# EAGLE schematic Replicape_A4 (EAGLE 6.5.0)
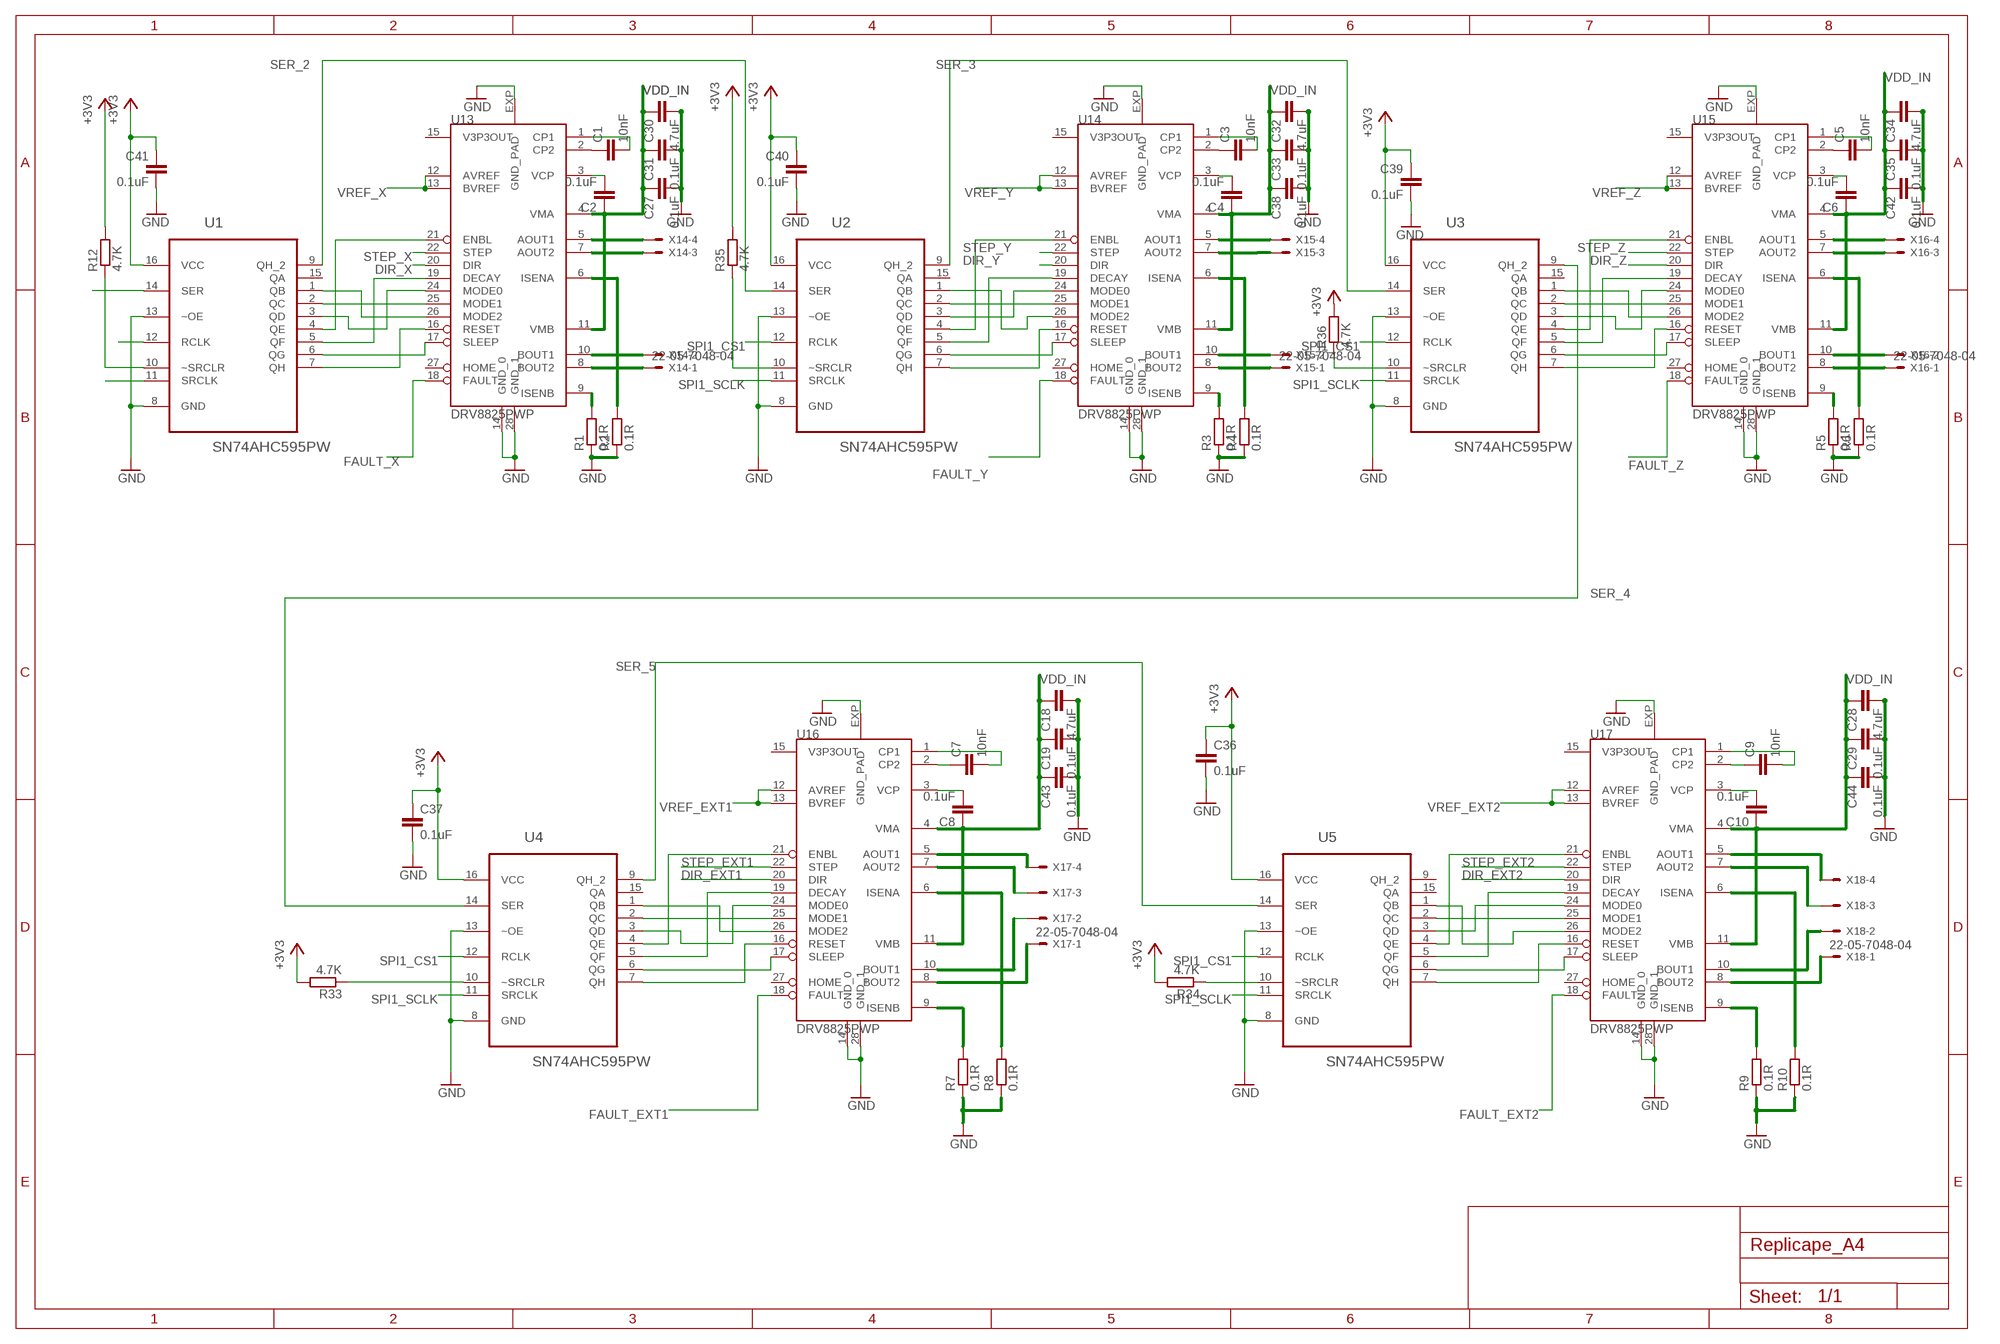
[diagram p0: schematic, sheet 1, part 1 of 3]
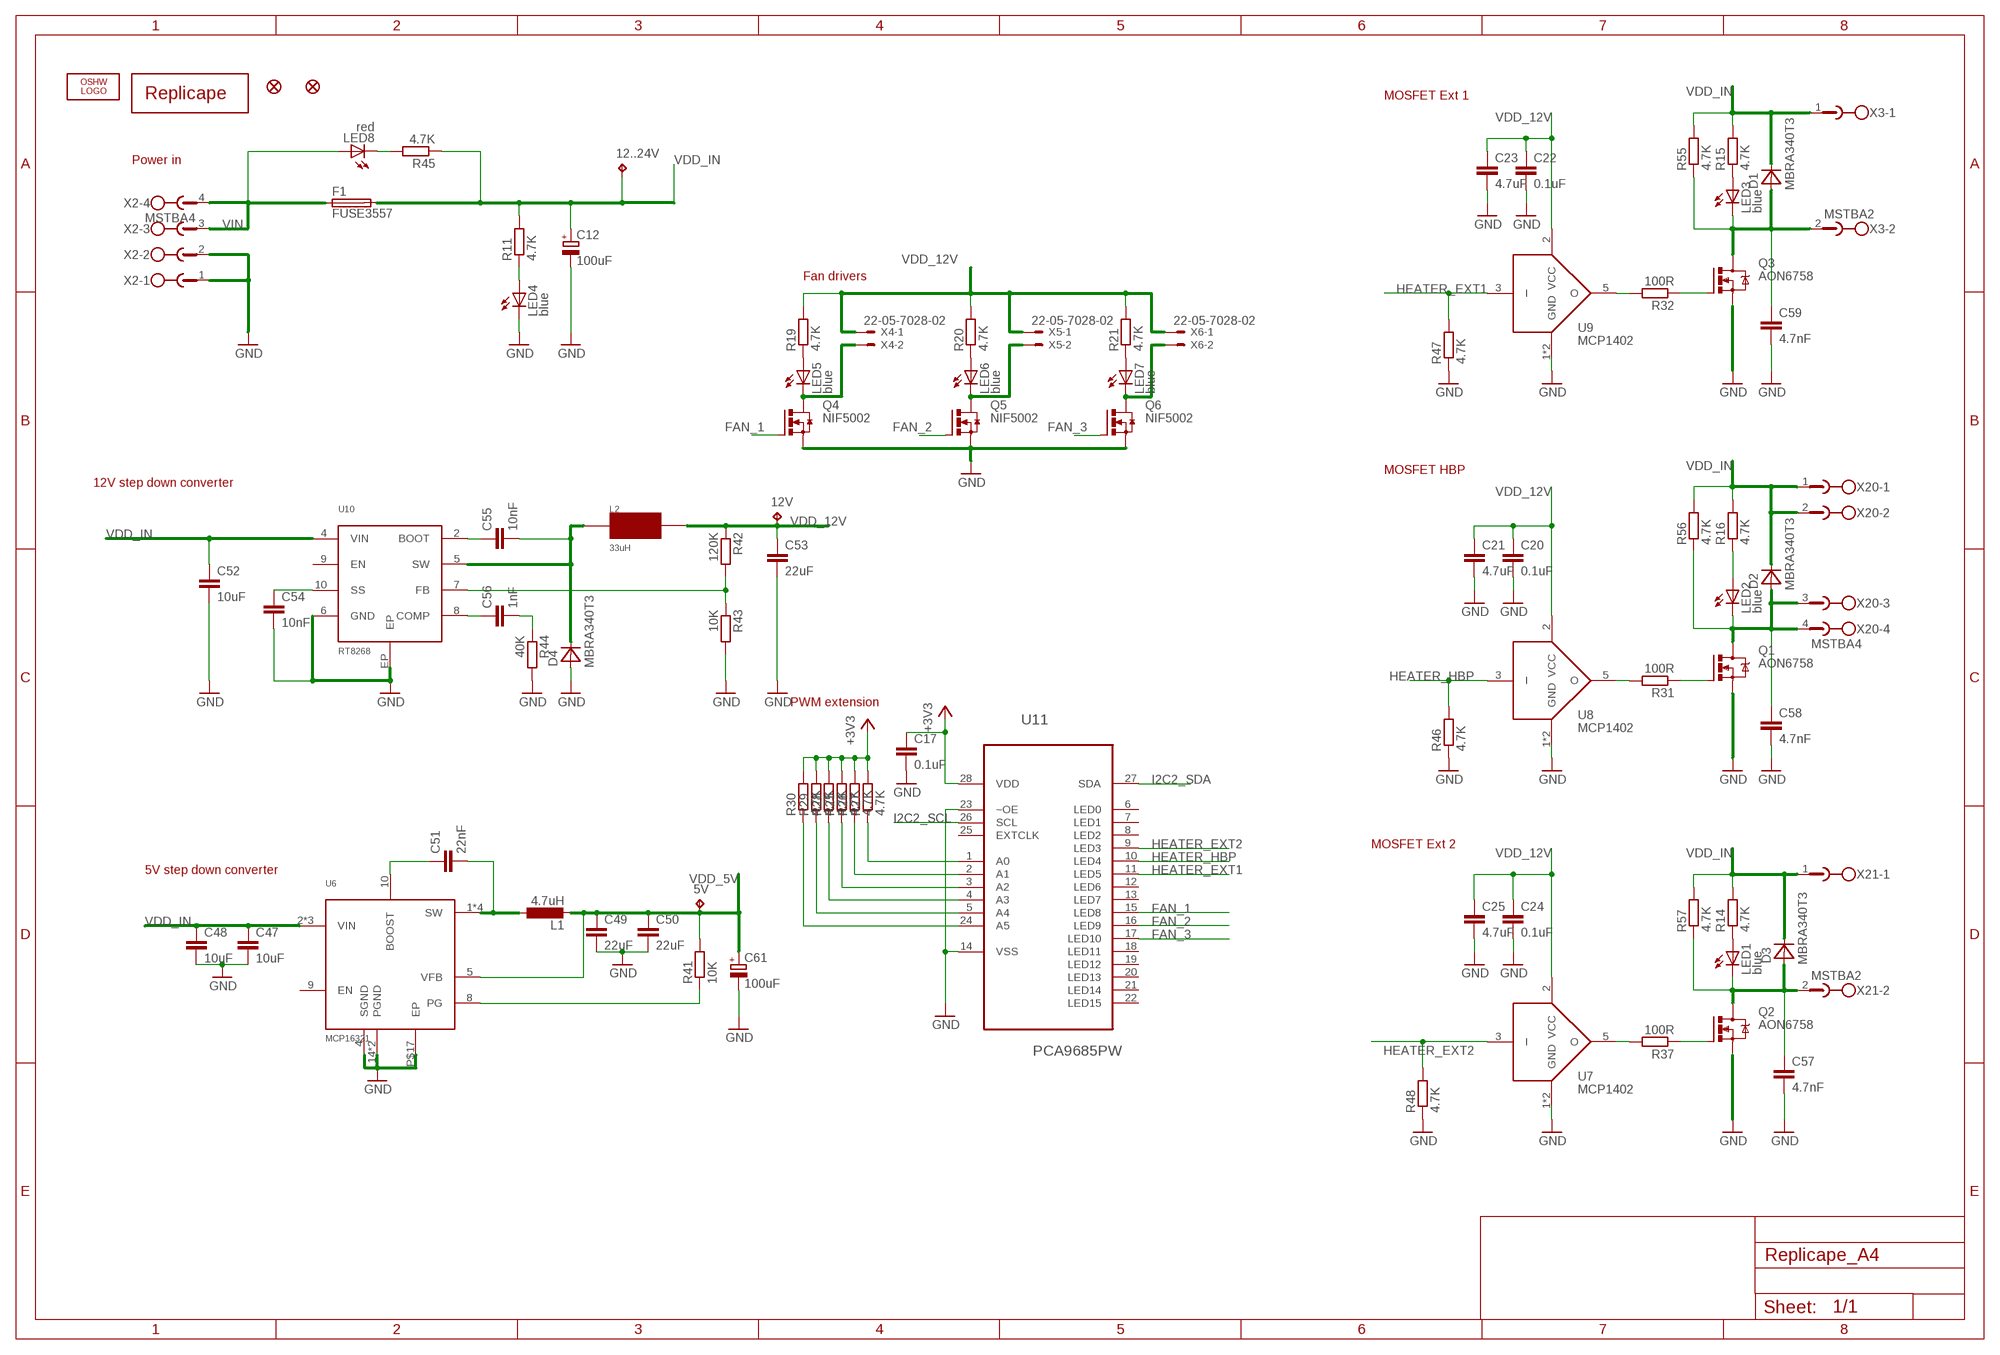
[diagram p1: schematic, sheet 1, part 2 of 3]
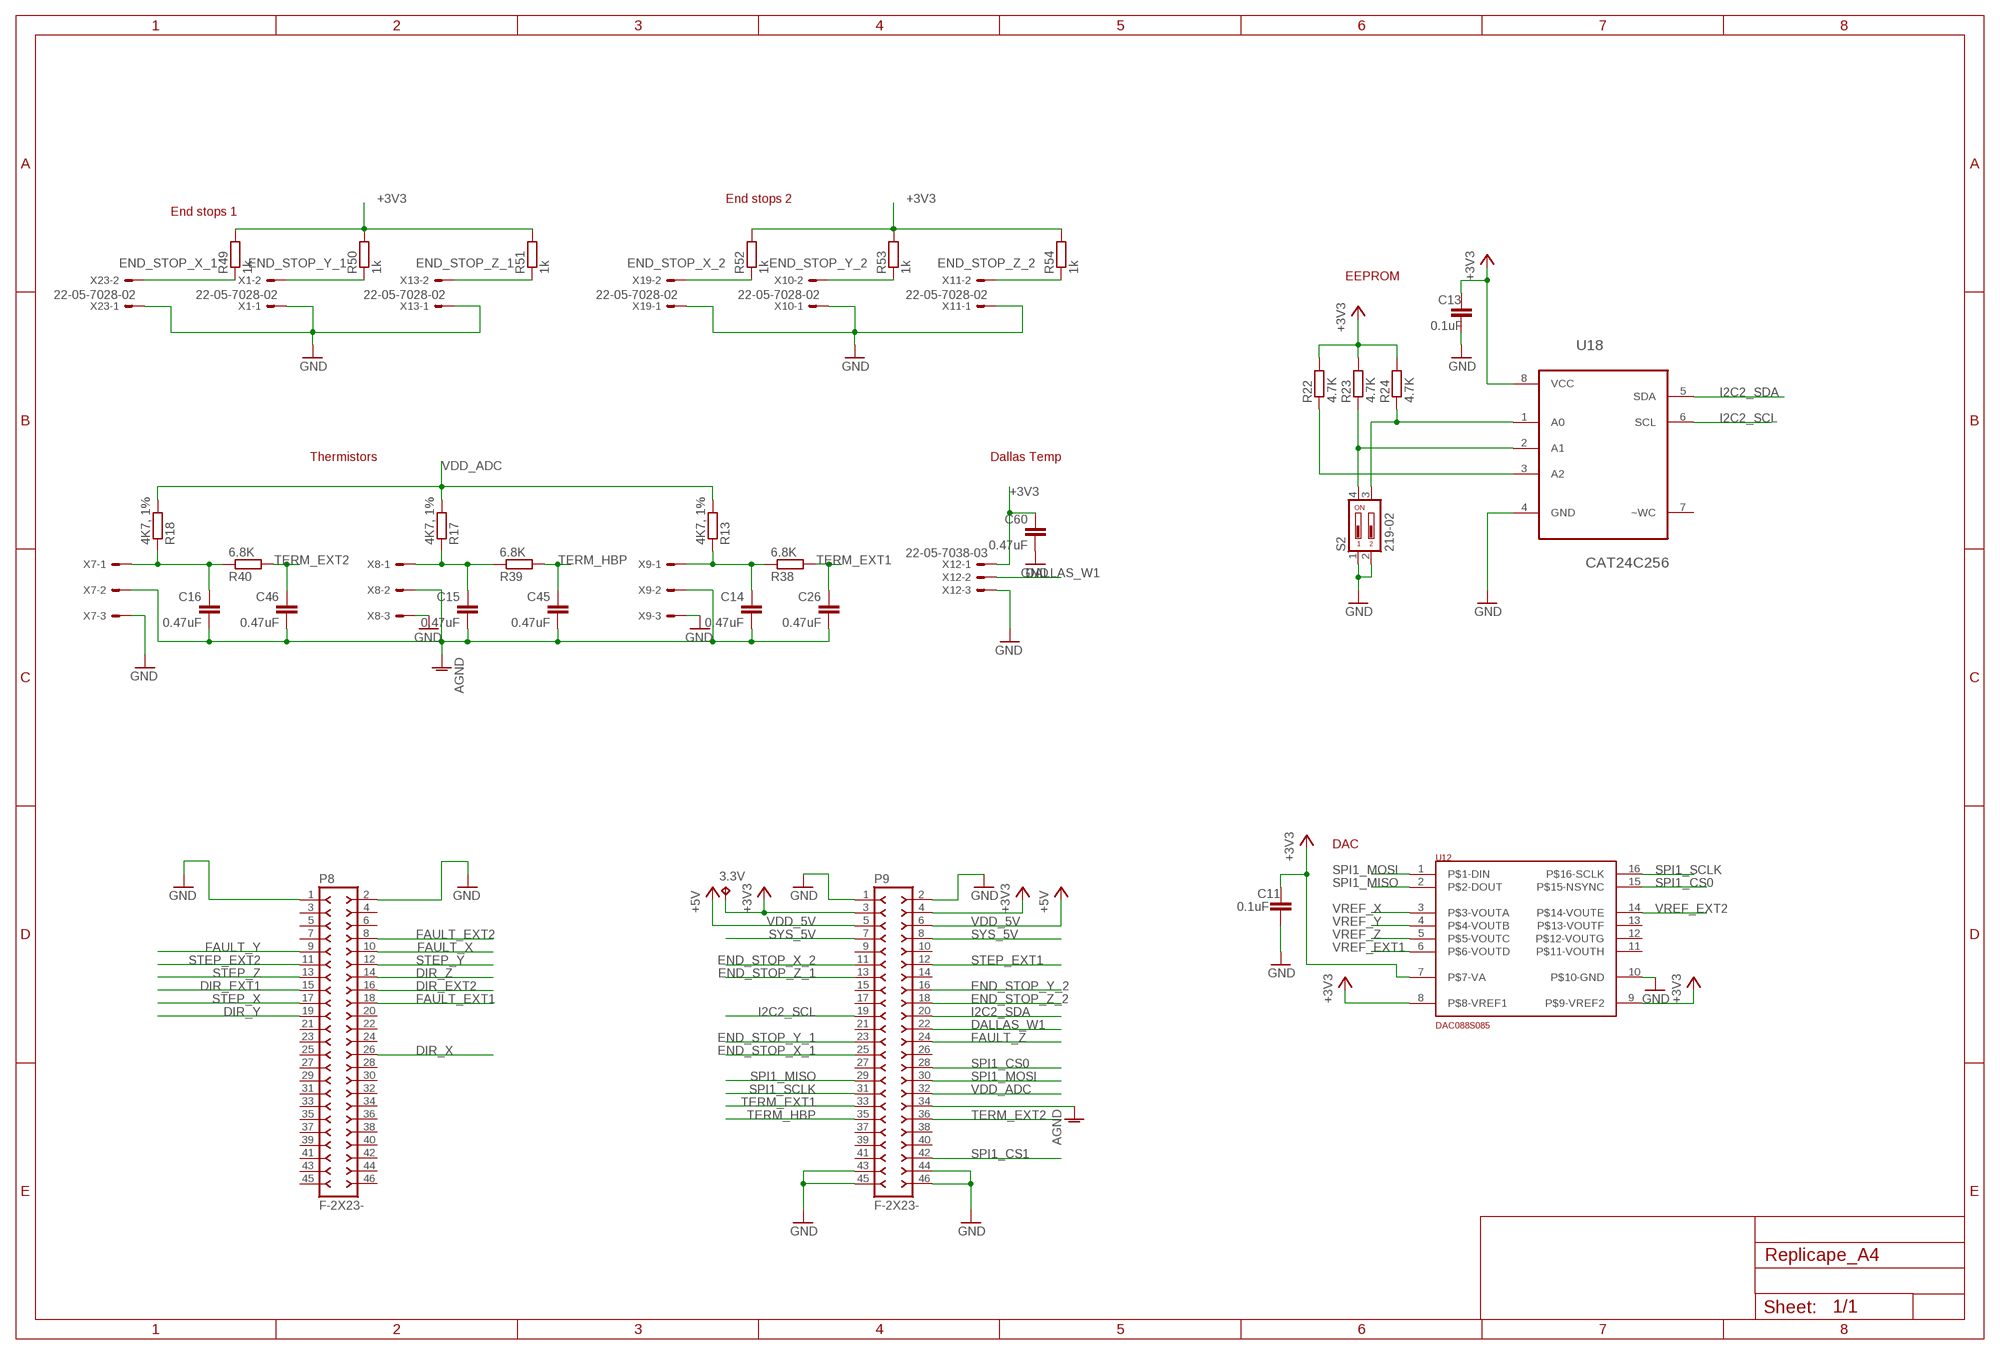
[diagram p2: schematic, sheet 1, part 3 of 3]

## Parts
3.3V  TPB1,27  [B1,27]
5V  TPB1,27  [B1,27]
12..24V  TPB1,27  [B1,27]
12V  TPB1,27  [B1,27]
C1  10nF  C-EUC0402  [C0402]
C2  0.1uF  C-EUC0402  [C0402]
C3  10nF  C-EUC0402  [C0402]
C4  0.1uF  C-EUC0402  [C0402]
C5  10nF  C-EUC0402  [C0402]
C6  0.1uF  C-EUC0402  [C0402]
C7  10nF  C-EUC0402  [C0402]
C8  0.1uF  C-EUC0402  [C0402]
C9  10nF  C-EUC0402  [C0402]
C10  0.1uF  C-EUC0402  [C0402]
C11  0.1uF  C-EUC0402  [C0402]
C12  100uF  CPOL-EU140CLH-0810  [140CLH-0810]
C13  0.1uF  C-EUC0402  [C0402]
C14  0.47uF  C-EUC0402  [C0402]
C15  0.47uF  C-EUC0402  [C0402]
C16  0.47uF  C-EUC0402  [C0402]
C17  0.1uF  C-EUC0402  [C0402]
C18  4.7uF  C-EUC0603  [C0603]
C19  0.1uF  C-EUC0402  [C0402]
C20  0.1uF  C-EUC0402  [C0402]
C21  4.7uF  C-EUC0402  [C0402]
C22  0.1uF  C-EUC0402  [C0402]
C23  4.7uF  C-EUC0402  [C0402]
C24  0.1uF  C-EUC0402  [C0402]
C25  4.7uF  C-EUC0402  [C0402]
C26  0.47uF  C-EUC0402  [C0402]
C27  0.1uF  C-EUC0402  [C0402]
C28  4.7uF  C-EUC0603  [C0603]
C29  0.1uF  C-EUC0402  [C0402]
C30  4.7uF  C-EUC0603  [C0603]
C31  0.1uF  C-EUC0402  [C0402]
C32  4.7uF  C-EUC0603  [C0603]
C33  0.1uF  C-EUC0402  [C0402]
C34  4.7uF  C-EUC0603  [C0603]
C35  0.1uF  C-EUC0402  [C0402]
C36  0.1uF  C-EUC0402  [C0402]
C37  0.1uF  C-EUC0402  [C0402]
C38  0.1uF  C-EUC0402  [C0402]
C39  0.1uF  C-EUC0402  [C0402]
C40  0.1uF  C-EUC0402  [C0402]
C41  0.1uF  C-EUC0402  [C0402]
C42  0.1uF  C-EUC0402  [C0402]
C43  0.1uF  C-EUC0402  [C0402]
C44  0.1uF  C-EUC0402  [C0402]
C45  0.47uF  C-EUC0402  [C0402]
C46  0.47uF  C-EUC0402  [C0402]
C47  10uF  C-EUC1206  [C1206]
C48  10uF  C-EUC1206  [C1206]
C49  22uF  C-EUC0805  [C0805]
C50  22uF  C-EUC0805  [C0805]
C51  22nF  C-EUC0402  [C0402]
C52  10uF  C-EUC1206  [C1206]
C53  22uF  C-EUC0805  [C0805]
C54  10nF  C-EUC0402  [C0402]
C55  10nF  C-EUC0402  [C0402]
C56  1nF  C-EUC0402  [C0402]
C57  4.7nF  C-EUC0402  [C0402]
C58  4.7nF  C-EUC0402  [C0402]
C59  4.7nF  C-EUC0402  [C0402]
C60  0.47uF  C-EUC0402  [C0402]
C61  100uF  CPOL-EU140CLH-0810  [140CLH-0810]
D1  MBRA340T3  [SMA]
D2  MBRA340T3  [SMA]
D3  MBRA340T3  [SMA]
D4  MBRA340T3  [SMA]
F1  FUSE3557  [3557]
JP1  FIDUCIAL1X2.5  [FIDUCIAL-1X2.5]
JP2  FIDUCIAL1X2.5  [FIDUCIAL-1X2.5]
L1  4.7uH  L-EUVLC  [VLC5020]
L2  33uH  RT8040T330  [NR8040T330]
LED1  blue  LEDCHIP-LED0603  [CHIP-LED0603]
LED2  blue  LEDCHIP-LED0603  [CHIP-LED0603]
LED3  blue  LEDCHIP-LED0603  [CHIP-LED0603]
LED4  blue  LEDCHIP-LED0603  [CHIP-LED0603]
LED5  blue  LEDCHIP-LED0603  [CHIP-LED0603]
LED6  blue  LEDCHIP-LED0603  [CHIP-LED0603]
LED7  blue  LEDCHIP-LED0603  [CHIP-LED0603]
LED8  red  LEDCHIP-LED0603  [CHIP-LED0603]
LOGO1  OSHW_LOGO_FILLX0200-NT  [OSHW_FILLX200_NOTEXT]
P8  F-2X23-  [DIL-100-2X23]
P9  F-2X23-  [DIL-100-2X23]
Q1  AON6758  [8-DFN-EP-(5X6)]
Q2  AON6758  [8-DFN-EP-(5X6)]
Q3  AON6758  [8-DFN-EP-(5X6)]
Q4  NIF5002  N-HEXFET-2D_SOT232-  [SOT223]
Q5  NIF5002  N-HEXFET-2D_SOT232-  [SOT223]
Q6  NIF5002  N-HEXFET-2D_SOT232-  [SOT223]
R1  0.1R  R-EU_R0805  [R0805]
R2  0.1R  R-EU_R0805  [R0805]
R3  0.1R  R-EU_R0805  [R0805]
R4  0.1R  R-EU_R0805  [R0805]
R5  0.1R  R-EU_R0805  [R0805]
R6  0.1R  R-EU_R0805  [R0805]
R7  0.1R  R-EU_R0805  [R0805]
R8  0.1R  R-EU_R0805  [R0805]
R9  0.1R  R-EU_R0805  [R0805]
R10  0.1R  R-EU_R0805  [R0805]
R11  4.7K  R-EU_R0402  [R0402]
R12  4.7K  R-EU_R0402  [R0402]
R13  4K7, 1%  R-EU_R0402  [R0402]
R14  4.7K  R-EU_R0402  [R0402]
R15  4.7K  R-EU_R0402  [R0402]
R16  4.7K  R-EU_R0402  [R0402]
R17  4K7, 1%  R-EU_R0402  [R0402]
R18  4K7, 1%  R-EU_R0402  [R0402]
R19  4.7K  R-EU_R0402  [R0402]
R20  4.7K  R-EU_R0402  [R0402]
R21  4.7K  R-EU_R0402  [R0402]
R22  4.7K  R-EU_R0402  [R0402]
R23  4.7K  R-EU_R0402  [R0402]
R24  4.7K  R-EU_R0402  [R0402]
R25  4.7K  R-EU_R0402  [R0402]
R26  4.7K  R-EU_R0402  [R0402]
R27  4.7K  R-EU_R0402  [R0402]
R28  4.7K  R-EU_R0402  [R0402]
R29  4.7K  R-EU_R0402  [R0402]
R30  4.7K  R-EU_R0402  [R0402]
R31  100R  R-EU_R0402  [R0402]
R32  100R  R-EU_R0402  [R0402]
R33  4.7K  R-EU_R0402  [R0402]
R34  4.7K  R-EU_R0402  [R0402]
R35  4.7K  R-EU_R0402  [R0402]
R36  4.7K  R-EU_R0402  [R0402]
R37  100R  R-EU_R0402  [R0402]
R38  6.8K  R-EU_R0402  [R0402]
R39  6.8K  R-EU_R0402  [R0402]
R40  6.8K  R-EU_R0402  [R0402]
R41  10K  R-EU_R0402  [R0402]
R42  120K  R-EU_R0402  [R0402]
R43  10K  R-EU_R0402  [R0402]
R44  40K  R-EU_R0402  [R0402]
R45  4.7K  R-EU_R0402  [R0402]
R46  4.7K  R-EU_R0402  [R0402]
R47  4.7K  R-EU_R0402  [R0402]
R48  4.7K  R-EU_R0402  [R0402]
R49  1k  R-EUR0402  [R0402]
R50  1k  R-EUR0402  [R0402]
R51  1k  R-EUR0402  [R0402]
R52  1k  R-EUR0402  [R0402]
R53  1k  R-EUR0402  [R0402]
R54  1k  R-EUR0402  [R0402]
R55  4.7K  R-EU_R0402  [R0402]
R56  4.7K  R-EU_R0402  [R0402]
R57  4.7K  R-EU_R0402  [R0402]
S2  219-02  [CTS-219-02]
U1  SN74AHC595PW  [SOP65P640X120-16N]
U2  SN74AHC595PW  [SOP65P640X120-16N]
U3  SN74AHC595PW  [SOP65P640X120-16N]
U4  SN74AHC595PW  [SOP65P640X120-16N]
U5  SN74AHC595PW  [SOP65P640X120-16N]
U6  MCP16321  [QFN-16]
U7  MCP1402  [SOT23-5L]
U8  MCP1402  [SOT23-5L]
U9  MCP1402  [SOT23-5L]
U10  RT8268  [MSOP10]
U11  PCA9685PW  [SOP65P640X110-28N]
U12  DAC088S085  [TSSOP-16]
U13  DRV8825PWP  [TSSOP-28]
U14  DRV8825PWP  [TSSOP-28]
U15  DRV8825PWP  [TSSOP-28]
U16  DRV8825PWP  [TSSOP-28]
U17  DRV8825PWP  [TSSOP-28]
U18  CAT24C256  [SOIC127P600X175-8N]
U$2  REPLICAPE-LOGO  [REPLICAPE-LOGO]
X1  22-05-7028-02  [7395-02]
X2  MSTBA4  [MSTBA4]
X3  MSTBA2  [MSTBA2]
X4  22-05-7028-02  [7395-02]
X5  22-05-7028-02  [7395-02]
X6  22-05-7028-02  [7395-02]
X7  22-05-7038-03  [7395-03]
X8  22-05-7038-03  [7395-03]
X9  22-05-7038-03  [7395-03]
X10  22-05-7028-02  [7395-02]
X11  22-05-7028-02  [7395-02]
X12  22-05-7038-03  [7395-03]
X13  22-05-7028-02  [7395-02]
X14  22-05-7048-04  [7395-04]
X15  22-05-7048-04  [7395-04]
X16  22-05-7048-04  [7395-04]
X17  22-05-7048-04  [7395-04]
X18  22-05-7048-04  [7395-04]
X19  22-05-7028-02  [7395-02]
X20  MSTBA4  [MSTBA4]
X21  MSTBA2  [MSTBA2]
X23  22-05-7028-02  [7395-02]

## Nets
+3V3: 3.3V.TP C11.1 C13.1 C17.1 C36.1 C37.1 C39.1 C40.1 C41.1 C60.1 P9.3 P9.4 R12.2 R22.2 R23.2 R24.2 R25.2 R26.2 R27.2 R28.2 R29.2 R30.2 R33.2 R34.2 R35.2 R36.2 R49.2 R50.2 R51.2 R52.2 R53.2 R54.2 U1.16(VCC) U2.16(VCC) U3.16(VCC) U4.16(VCC) U5.16(VCC) U11.28(VDD) U12.7(P$7-VA) U12.8(P$8-VREF1) U12.9(P$9-VREF2) U18.8(VCC) X12.1
AGND: C14.2 C15.2 C16.2 C26.2 C45.2 C46.2 P9.34 X7.2 X8.2 X9.2
DALLAS_W1: P9.22 X12.2
DIR_EXT1: P8.15 U16.20(DIR)
DIR_EXT2: P8.16 U17.20(DIR)
DIR_X: P8.26 U13.20(DIR)
DIR_Y: P8.19 U14.20(DIR)
DIR_Z: P8.14 U15.20(DIR)
END_STOP_X_1: P9.25 R49.1 X23.2
END_STOP_X_2: P9.11 R52.1 X19.2
END_STOP_Y_1: P9.23 R50.1 X1.2
END_STOP_Y_2: P9.16 R53.1 X10.2
END_STOP_Z_1: P9.13 R51.1 X13.2
END_STOP_Z_2: P9.18 R54.1 X11.2
EXT1_DECAY: U4.5(QF) U16.19(DECAY)
EXT1_MODE0: U4.3(QD) U16.24(MODE0)
EXT1_MODE1: U4.2(QC) U16.25(MODE1)
EXT1_MODE2: U4.1(QB) U16.26(MODE2)
EXT1_NENABLE: U4.4(QE) U16.21(ENBL)
EXT1_NRESET: U4.7(QH) U16.16(RESET)
EXT1_NSLEEP: U4.6(QG) U16.17(SLEEP)
EXT2_DECAY: U5.5(QF) U17.19(DECAY)
EXT2_MODE0: U5.3(QD) U17.24(MODE0)
EXT2_MODE1: U5.2(QC) U17.25(MODE1)
EXT2_MODE2: U5.1(QB) U17.26(MODE2)
EXT2_NENABLE: U5.4(QE) U17.21(ENBL)
EXT2_NRESET: U5.7(QH) U17.16(RESET)
EXT2_NSLEEP: U5.6(QG) U17.17(SLEEP)
FAN_1: Q4.1(G) U11.15(LED8)
FAN_2: Q5.1(G) U11.16(LED9)
FAN_3: Q6.1(G) U11.17(LED10)
FAULT_EXT1: P8.18 U16.18(FAULT)
FAULT_EXT2: P8.8 U17.18(FAULT)
FAULT_X: P8.10 U13.18(FAULT)
FAULT_Y: P8.9 U14.18(FAULT)
FAULT_Z: P9.24 U15.18(FAULT)
GND: C11.2 C12.- C13.2 C17.2 C18.2 C19.2 C20.2 C21.2 C22.2 C23.2 C24.2 C25.2 C27.2 C28.2 C29.2 C30.2 C31.2 C32.2 C33.2 C34.2 C35.2 C36.2 C37.2 C38.2 C39.2 C40.2 C41.2 C42.2 C43.2 C44.2 C47.2 C48.2 C49.2 C50.2 C52.2 C53.2 C54.2 C57.2 C58.2 C59.2 C60.2 C61.- D4.A LED4.C P8.1 P8.2 P9.1 P9.2 P9.43 P9.44 P9.45 P9.46 Q1.1(S) Q1.2(S) Q1.3(S) Q2.1(S) Q2.2(S) Q2.3(S) Q3.1(S) Q3.2(S) Q3.3(S) Q4.3(S) Q5.3(S) Q6.3(S) R1.1 R2.1 R3.1 R4.1 R5.1 R6.1 R7.1 R8.1 R9.1 R10.1 R43.2 R44.2 R46.1 R47.1 R48.1 S2.1 S2.2 U1.8(GND) U1.13(~OE) U2.8(GND) U2.13(~OE) U3.8(GND) U3.13(~OE) U4.8(GND) U4.13(~OE) U5.8(GND) U5.13(~OE) U6.4(SGND) U6.14(PGND) U6.15(PGND) U6.P$17(EP) U7.1(GND) U7.4(GND) U8.1(GND) U8.4(GND) U9.1(GND) U9.4(GND) U10.6(GND) U10.EP U11.14(VSS) U11.23(~OE) U12.10(P$10-GND) U13.14(GND_0) U13.28(GND_1) U13.EXP(GND_PAD) U14.14(GND_0) U14.28(GND_1) U14.EXP(GND_PAD) U15.14(GND_0) U15.28(GND_1) U15.EXP(GND_PAD) U16.14(GND_0) U16.28(GND_1) U16.EXP(GND_PAD) U17.14(GND_0) U17.28(GND_1) U17.EXP(GND_PAD) U18.4(GND) X1.1 X2.1 X2.2 X7.3 X8.3 X9.3 X10.1 X11.1 X12.3 X13.1 X19.1 X23.1
HEATER_EXT1: R47.2 U9.3(I) U11.11(LED5)
HEATER_EXT2: R48.2 U7.3(I) U11.9(LED3)
HEATER_HBP: R46.2 U8.3(I) U11.10(LED4)
I2C2_SCL: P9.19 U11.26(SCL) U18.6(SCL)
I2C2_SDA: P9.20 U11.27(SDA) U18.5(SDA)
N$8: LED8.C R45.2
N$9: LED5.A R19.1
N$16: C1.1 U13.2(CP2)
N$17: C1.2 U13.1(CP1)
N$18: R1.2 U13.9(ISENB)
N$19: R2.2 U13.6(ISENA)
N$21: R32.2 U9.5(O)
N$22: C2.2 U13.3(VCP)
N$23: Q2.4(G) R37.1
N$34: C3.1 U14.2(CP2)
N$35: C3.2 U14.1(CP1)
N$36: R3.2 U14.9(ISENB)
N$37: R4.2 U14.6(ISENA)
N$38: C4.2 U14.3(VCP)
N$41: R37.2 U7.5(O)
N$52: C5.1 U15.2(CP2)
N$53: C5.2 U15.1(CP1)
N$54: R5.2 U15.9(ISENB)
N$55: R6.2 U15.6(ISENA)
N$56: C6.2 U15.3(VCP)
N$58: R27.1 U11.1(A0)
N$59: R26.1 U11.2(A1)
N$60: Q1.4(G) R31.1
N$61: R31.2 U8.5(O)
N$64: C57.1 D3.A LED1.C Q2.5(D) Q2.6(D) Q2.7(D) Q2.8(D) Q2.TH(D) R57.1 X21.2
N$70: C7.1 U16.2(CP2)
N$71: C7.2 U16.1(CP1)
N$72: R7.2 U16.9(ISENB)
N$73: R8.2 U16.6(ISENA)
N$74: C8.2 U16.3(VCP)
N$76: R25.1 U11.3(A2)
N$88: C9.1 U17.2(CP2)
N$89: C9.2 U17.1(CP1)
N$90: R9.2 U17.9(ISENB)
N$91: R10.2 U17.6(ISENA)
N$92: C10.2 U17.3(VCP)
N$94: R28.1 U11.4(A3)
N$95: R29.1 U11.5(A4)
N$96: LED4.A R11.1
N$97: R12.1 U1.10(~SRCLR)
N$98: R33.1 U4.10(~SRCLR)
N$99: R34.1 U5.10(~SRCLR)
N$100: R35.1 U2.10(~SRCLR)
N$101: R36.1 U3.10(~SRCLR)
N$112: R30.1 U11.24(A5)
N$114: LED7.C Q6.2(D) Q6.4(D) X6.2
N$115: LED6.C Q5.2(D) Q5.4(D) X5.2
N$116: LED5.C Q4.2(D) Q4.4(D) X4.2
N$117: LED6.A R20.1
N$118: LED7.A R21.1
N$127: LED3.A R15.1
N$128: C51.1 U6.10(BOOST)
N$129: LED1.A R14.1
N$130: LED2.A R16.1
N$133: Q3.4(G) R32.1
N$147: R24.1 S2.3 U18.1(A0)
N$148: R23.1 S2.4 U18.2(A1)
N$149: R22.1 U18.3(A2)
N$233: R42.2 R43.1 U10.7(FB)
N$234: C59.1 D1.A LED3.C Q3.5(D) Q3.6(D) Q3.7(D) Q3.8(D) Q3.TH(D) R55.1 X3.2
N$237: C14.1 R13.1 R38.1 X9.1
N$238: C55.2 D4.C L2.P$2 U10.5(SW)
N$239: R41.1 U6.8(PG)
N$240: C16.1 R18.1 R40.1 X7.1
N$241: C15.1 R17.1 R39.1 X8.1
N$242: C58.1 D2.A LED2.C Q1.5(D) Q1.6(D) Q1.7(D) Q1.8(D) Q1.TH(D) R56.1 X20.3 X20.4
N$243: C54.1 U10.10(SS)
N$244: C56.1 U10.8(COMP)
N$245: C55.1 U10.2(BOOT)
N$246: C56.2 R44.1
SER_2: U1.9(QH_2) U2.14(SER)
SER_3: U2.9(QH_2) U3.14(SER)
SER_4: U3.9(QH_2) U4.14(SER)
SER_5: U4.9(QH_2) U5.14(SER)
SPI1_CS0: P9.28 U12.15(P$15-NSYNC)
SPI1_CS1: P9.42 U1.12(RCLK) U2.12(RCLK) U3.12(RCLK) U4.12(RCLK) U5.12(RCLK)
SPI1_MISO: P9.29 U12.2(P$2-DOUT)
SPI1_MOSI: P9.30 U1.14(SER) U12.1(P$1-DIN)
SPI1_SCLK: P9.31 U1.11(SRCLK) U2.11(SRCLK) U3.11(SRCLK) U4.11(SRCLK) U5.11(SRCLK) U12.16(P$16-SCLK)
STEP1_EXT1: U16.5(AOUT1) X17.4
STEP1_EXT2: U17.5(AOUT1) X18.4
STEP1_X: U13.5(AOUT1) X14.4
STEP1_Y: U14.5(AOUT1) X15.4
STEP1_Z: U15.5(AOUT1) X16.4
STEP2_EXT1: U16.7(AOUT2) X17.3
STEP2_EXT2: U17.7(AOUT2) X18.3
STEP2_X: U13.7(AOUT2) X14.3
STEP2_Y: U14.7(AOUT2) X15.3
STEP2_Z: U15.7(AOUT2) X16.3
STEP3_EXT1: U16.10(BOUT1) X17.2
STEP3_EXT2: U17.10(BOUT1) X18.2
STEP3_X: U13.10(BOUT1) X14.2
STEP3_Y: U14.10(BOUT1) X15.2
STEP3_Z: U15.10(BOUT1) X16.2
STEP4_EXT1: U16.8(BOUT2) X17.1
STEP4_EXT2: U17.8(BOUT2) X18.1
STEP4_X: U13.8(BOUT2) X14.1
STEP4_Y: U14.8(BOUT2) X15.1
STEP4_Z: U15.8(BOUT2) X16.1
STEP_EXT1: P9.12 U16.22(STEP)
STEP_EXT2: P8.11 U17.22(STEP)
STEP_X: P8.17 U13.22(STEP)
STEP_Y: P8.12 U14.22(STEP)
STEP_Z: P8.13 U15.22(STEP)
SW: C51.2 L1.1 U6.1(SW) U6.12(SW) U6.13(SW) U6.16(SW)
SYS_5V: P9.7 P9.8
TERM_EXT1: C26.1 P9.33 R38.2
TERM_EXT2: C46.1 P9.36 R40.2
TERM_HBP: C45.1 P9.35 R39.2
VDD_5V: 5V.TP C49.1 C50.1 C61.+ L1.2 P9.5 P9.6 R41.2 U6.5(VFB) ; supply symbol labelled +5V
VDD_12V: 12V.TP C20.1 C21.1 C22.1 C23.1 C24.1 C25.1 C53.1 L2.P$1 R19.2 R20.2 R21.2 R42.1 U7.2(VCC) U8.2(VCC) U9.2(VCC) X4.1 X5.1 X6.1
VDD_ADC: P9.32 R13.2 R17.2 R18.2
VDD_IN: 12..24V.TP C2.1 C4.1 C6.1 C8.1 C10.1 C12.+ C18.1 C19.1 C27.1 C28.1 C29.1 C30.1 C31.1 C32.1 C33.1 C34.1 C35.1 C38.1 C42.1 C43.1 C44.1 C47.1 C48.1 C52.1 D1.C D2.C D3.C F1.3 F1.4 R11.2 R14.2 R15.2 R16.2 R45.1 R55.2 R56.2 R57.2 U6.2(VIN) U6.3(VIN) U6.11(VIN) U10.4(VIN) U13.4(VMA) U13.11(VMB) U14.4(VMA) U14.11(VMB) U15.4(VMA) U15.11(VMB) U16.4(VMA) U16.11(VMB) U17.4(VMA) U17.11(VMB) X3.1 X20.1 X20.2 X21.1
VIN: F1.1 F1.2 LED8.A X2.3 X2.4
VREF_EXT1: U12.6(P$6-VOUTD) U16.12(AVREF) U16.13(BVREF)
VREF_EXT2: U12.14(P$14-VOUTE) U17.12(AVREF) U17.13(BVREF)
VREF_X: U12.3(P$3-VOUTA) U13.12(AVREF) U13.13(BVREF)
VREF_Y: U12.4(P$4-VOUTB) U14.12(AVREF) U14.13(BVREF)
VREF_Z: U12.5(P$5-VOUTC) U15.12(AVREF) U15.13(BVREF)
X_DECAY: U1.5(QF) U13.19(DECAY)
X_MODE0: U1.3(QD) U13.24(MODE0)
X_MODE1: U1.2(QC) U13.25(MODE1)
X_MODE2: U1.1(QB) U13.26(MODE2)
X_NENABLE: U1.4(QE) U13.21(ENBL)
X_NRESET: U1.7(QH) U13.16(RESET)
X_NSLEEP: U1.6(QG) U13.17(SLEEP)
Y_DECAY: U2.5(QF) U14.19(DECAY)
Y_MODE0: U2.3(QD) U14.24(MODE0)
Y_MODE1: U2.2(QC) U14.25(MODE1)
Y_MODE2: U2.1(QB) U14.26(MODE2)
Y_NENABLE: U2.4(QE) U14.21(ENBL)
Y_NRESET: U2.7(QH) U14.16(RESET)
Y_NSLEEP: U2.6(QG) U14.17(SLEEP)
Z_DECAY: U3.5(QF) U15.19(DECAY)
Z_MODE0: U3.3(QD) U15.24(MODE0)
Z_MODE1: U3.2(QC) U15.25(MODE1)
Z_MODE2: U3.1(QB) U15.26(MODE2)
Z_NENABLE: U3.4(QE) U15.21(ENBL)
Z_NRESET: U3.7(QH) U15.16(RESET)
Z_NSLEEP: U3.6(QG) U15.17(SLEEP)
Unconnected: P8.3 P8.4 P8.5 P8.6 P8.7 P8.20 P8.21 P8.22 P8.23 P8.24 P8.25 P8.27 P8.28 P8.29 P8.30 P8.31 P8.32 P8.33 P8.34 P8.35 P8.36 P8.37 P8.38 P8.39 P8.40 P8.41 P8.42 P8.43 P8.44 P8.45 P8.46 P9.9 P9.10 P9.14 P9.15 P9.17 P9.21 P9.26 P9.27 P9.37 P9.38 P9.39 P9.40 P9.41 U1.15(QA) U2.15(QA) U3.15(QA) U4.15(QA) U5.9(QH_2) U5.15(QA) U6.9(EN) U10.9(EN) U11.6(LED0) U11.7(LED1) U11.8(LED2) U11.12(LED6) U11.13(LED7) U11.18(LED11) U11.19(LED12) U11.20(LED13) U11.21(LED14) U11.22(LED15) U11.25(EXTCLK) U12.11(P$11-VOUTH) U12.12(P$12-VOUTG) U12.13(P$13-VOUTF) U13.15(V3P3OUT) U13.27(HOME) U14.15(V3P3OUT) U14.27(HOME) U15.15(V3P3OUT) U15.27(HOME) U16.15(V3P3OUT) U16.27(HOME) U17.15(V3P3OUT) U17.27(HOME) U18.7(~WC)

## Notes on the sheet
- MOSFET Ext 1
- Power in
- End stops 2
- End stops 1
- Fan drivers | EEPROM
- Thermistors | Dallas Temp
- MOSFET HBP
- 12V step down converter
- PWM extension
- MOSFET Ext 2 | DAC
- 5V step down converter

## Library data of the parts
3.3V 5V 12..24V 12V = testpad:TP: Test pad
C1-C11 C13-C60 = rcl:C-EU: CAPACITOR, European symbol
C12 C61 = rcl:CPOL-EU: POLARIZED CAPACITOR, European symbol
D1-D4 = diode:MBRA340T3: Surface Mount Schottky Power Rectifier Source: http://www.onsemi.com/pub_link/Collateral/MBRA340T3-D.PDF
F1 = fuse:FUSE: Fuse
JP1 JP2 = SparkFun:FIDUCIAL: Fiducial Alignment Points Various fiducial points for machine vision alignment.
L1 = resistor:L-EU: INDUCTOR, European symbol
L2 = SparkFun:RT8040T330
LED1-LED8 = led:LED: LED OSRAM: - CHIPLED LG R971, LG N971, LY N971, LG Q971, LY Q971, LO R971, LY R971 LH N974, LH R974 LS Q976, LO Q976, LY Q976 LO Q996 - Hyper CHIPLED LW Q18S LB Q993, LB Q99A, LB R99A - SideLED LS A670, LO A670, LY A670, LG A670, LP A670 LB A673, LV A673, LT A673, LW A673 LH A674 LY A675 LS A676, LA A676, LO A676, LY A676, LW A676 LS A679, LY A679, LG A679 - Hyper Micro SIDELED® LS Y876, LA Y876, LO Y876, LY Y876 LT Y87S - SmartLED LW L88C, LW L88S LB L89C, LB L89S, LG L890 LS L89K, LO L89K, LY L89K LS L896, LA L896, LO L896, LY L896 - TOPLED LS T670, LO T670, LY T670, LG T670, LP T670 LSG T670, LSP T670, LSY T670, LOP T670, LYG T670 LG T671, LOG T671, LSG T671 LB T673, LV T673, LT T673, LW T673 LH T674 LS T676, LA T676, LO T676, LY T676, LB T676, LH T676, LSB T676, LW T676 LB T67C, LV T67C, LT T67C, LS T67K, LO T67K, LY T67K, LW E67C LS E67B, LA E67B, LO E67B, LY E67B, LB E67C, LV E67C, LT E67C LW T67C LS T679, LY T679, LG T679 LS T770, LO T770, LY T770, LG T770, LP T770 LB T773, LV T773, LT T773, LW T773 LH T774 LS E675, LA E675, LY E675, LS T675 LS T776, LA T776, LO T776, LY T776, LB T776 LHGB T686 LT T68C, LB T68C - Hyper Mini TOPLED® LB M676 - Mini TOPLED Santana® LG M470 LS M47K, LO M47K, LY M47K Source: http://www.osram.convergy.de LUXEON: - LUMILED® LXK2-PW12-R00, LXK2-PW12-S00, LXK2-PW14-U00, LXK2-PW14-V00 LXK2-PM12-R00, LXK2-PM12-S00, LXK2-PM14-U00 LXK2-PE12-Q00, LXK2-PE12-R00, LXK2-PE12-S00, LXK2-PE14-T00, LXK2-PE14-U00 LXK2-PB12-K00, LXK2-PB12-L00, LXK2-PB12-M00, LXK2-PB14-N00, LXK2-PB14-P00, LXK2-PB14-Q00 LXK2-PR12-L00, LXK2-PR12-M00, LXK2-PR14-Q00, LXK2-PR14-R00 LXK2-PD12-Q00, LXK2-PD12-R00, LXK2-PD12-S00 LXK2-PH12-R00, LXK2-PH12-S00 LXK2-PL12-P00, LXK2-PL12-Q00, LXK2-PL12-R00 Source: www.luxeon.com KINGBRIGHT: KA-3528ASYC Source: www.kingbright.com
LOGO1 = ohw-logo:OSHW_LOGO_FILL
P8 P9 = con-headers-jp:F-2X23-
Q1-Q3 = transistor-power:AON6758
Q4-Q6 = transistor-power:N-HEXFET-2D_?-*: HEXFET® Power MOSFET 2 Drain connects http://www.irf.com/product-info/datasheets/data/irll014n.pdf
R1-R48 R55-R57 = rcl:R-EU_: RESISTOR, European symbol
R49-R54 = rcl-2:R-EU: RESISTOR, European symbol
S2 = switch-dil:219-02*: Surface Mount DIP Switch Series 219 SMT CTS Electronic Components Sourc: www.ctscorp.com; OC_FARNELL: unknown; OC_NEWARK: unknown
U1-U5 = sn74hc595:SN74AHC595PW: 8 bit shift registers with 3-state output registers; MPN: SN74AHC595PW; OC_FARNELL: 1741463; OC_NEWARK: 50R5930; PACKAGE: TSSOP-16; SUPPLIER: Texas Instruments
U6 = SparkFun:MCP16321
U7-U9 = microchip-6:MCP1402: MOSFET driver
U10 = SparkFun:RT8268
U11 = custom:PCA9685PW: 16-channel, 12-bit PWM Fm+ I2C-bus LED controller; MPN: PCA9685PW; OC_FARNELL: 1854074; OC_NEWARK: 19T6398; PACKAGE: TSSOP-28; SUPPLIER: NXP
U12 = dac88s:DAC088S085
U13-U17 = drv88xx:DRV8825PWP
U18 = custom:CAT24C256
U$2 = replicape:REPLICAPE-LOGO
X1 X4-X6 X10 X11 X13 X19 X23 = con-molex:22-?-02: CONNECTOR wire to board 2.54 mm (.1 inch) pitch header; OC_FARNELL: 9731601; OC_NEWARK: unknown
X2 X20 = con-phoenix-508:MSTBA4: PHOENIX
X3 X21 = con-phoenix-508:MSTBA2: PHOENIX
X7-X9 X12 = con-molex:22-?-03: CONNECTOR wire to board 2.54 mm (.1 inch) pitch header; OC_FARNELL: unknown; OC_NEWARK: unknown
X14-X18 = con-molex:22-?-04: CONNECTOR wire to board 2.54 mm (.1 inch) pitch header; OC_FARNELL: unknown; OC_NEWARK: unknown

## Net classes
1 power: width 1.27 mm